# Altium schematic sheet VGA.SchDoc
size A4
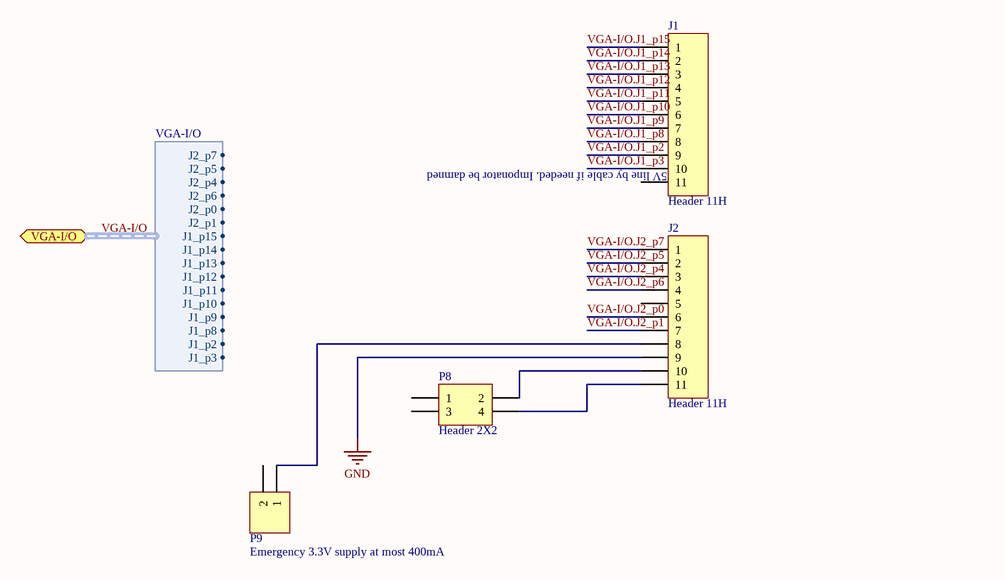
[diagram p0: VGA.SchDoc]

## Parts
J1  Header 11H  [HDR1X11H]
J2  Header 11H  [HDR1X11H]
P8  Header 2X2  [HDR2X2]
P9  Emergency 3.3V supply at most 400mA  [HDR1X2]

## Ports
VGA-I/O (harness VGA-I/O)

## Harnesses
VGA-I/O: J2_p7, J2_p5, J2_p4, J2_p6, J2_p0, J2_p1, J1_p15, J1_p14, J1_p13, J1_p12, J1_p11, J1_p10, J1_p9, J1_p8, J1_p2, J1_p3

## Nets
GND: J2.9
VGA-I/O.J1_p2: J1.9
VGA-I/O.J1_p3: J1.10
VGA-I/O.J1_p8: J1.8
VGA-I/O.J1_p9: J1.7
VGA-I/O.J1_p10: J1.6
VGA-I/O.J1_p11: J1.5
VGA-I/O.J1_p12: J1.4
VGA-I/O.J1_p13: J1.3
VGA-I/O.J1_p14: J1.2
VGA-I/O.J1_p15: J1.1
VGA-I/O.J2_p0: J2.6
VGA-I/O.J2_p1: J2.7
VGA-I/O.J2_p4: J2.3
VGA-I/O.J2_p5: J2.2
VGA-I/O.J2_p6: J2.4
VGA-I/O.J2_p7: J2.1
NetJ2_8: J2.8 P9.1
NetJ2_10: J2.10 P8.2
NetJ2_11: J2.11 P8.4

Not connected (* = marked no-connect by the designer): J1 11; J2 5; P8 1 3; P9 2

## Buses and harness runs
harness VGA-I/O = port VGA-I/O

## Notes on the sheet
- (near J1) 5V line by cable if needed. Imponator be damned

## Library data of the parts
J1 J2 = Header 11H: Header, 11-Pin, Right Angle; LatestRevisionDate: 17-Jul-2002; LatestRevisionNote: Re-released for DXP Platform.; Publisher: Altium Limited
P8 = Header 2X2: Header, 2-Pin, Dual row; LatestRevisionDate: 17-Jul-2002; LatestRevisionNote: Re-released for DXP Platform.; Publisher: Altium Limited
P9 = Header 2: Header, 2-Pin; LatestRevisionDate: 17-Jul-2002; LatestRevisionNote: Re-released for DXP Platform.; Publisher: Altium Limited